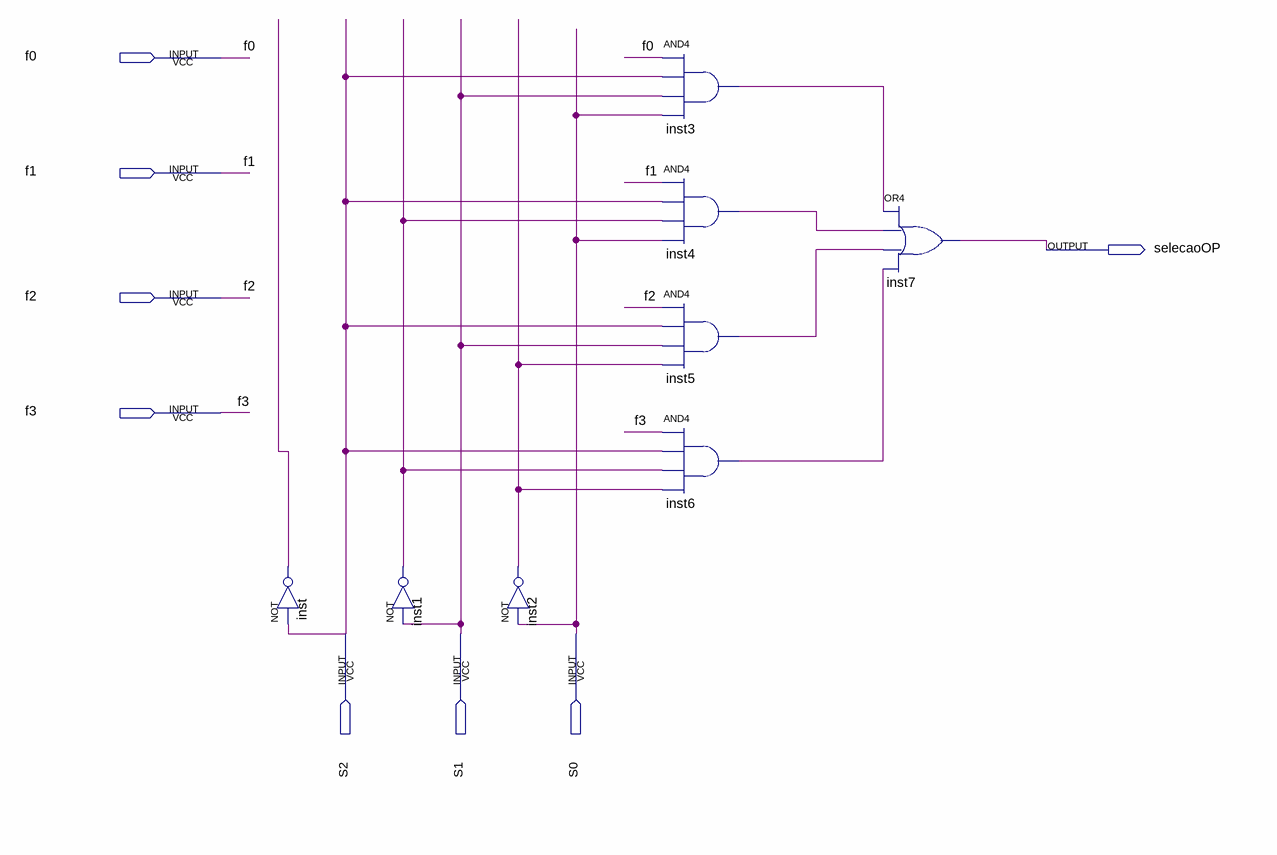
[diagram p0: schematic sheet]
// Quartus schematic parteInferior.bdf as structural Verilog: 8 symbols, 8 pins
module parteInferior (
  input  f0,
  input  f1,
  input  f2,
  input  f3,
  input  S2,
  input  S1,
  input  S0,
  output selecaoOP
);

  wire inst1_out, inst2_out, inst3_out, inst4_out, inst5_out, inst6_out, inst_out;

  not inst (inst_out, S2);
  not inst1 (inst1_out, S1);
  not inst2 (inst2_out, S0);
  and inst3 (inst3_out, f0, S2, S1, S0);
  and inst4 (inst4_out, f1, S2, inst1_out, S0);
  and inst5 (inst5_out, f2, S2, S1, inst2_out);
  and inst6 (inst6_out, f3, S2, inst1_out, inst2_out);
  or inst7 (selecaoOP, inst3_out, inst4_out, inst5_out, inst6_out);
endmodule
